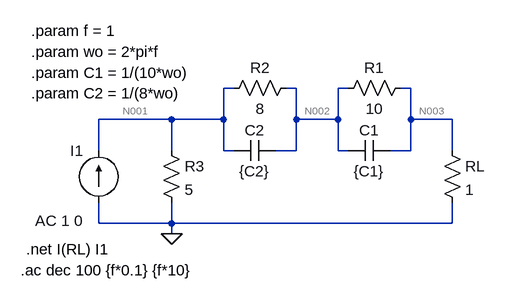
[diagram p0: schematic EJ1.asc]
EJ1.asc, the LTspice schematic file:
Version 4
SHEET 1 880 680
WIRE 144 32 128 32
WIRE 240 32 224 32
WIRE 320 32 304 32
WIRE 416 32 400 32
WIRE 48 80 -64 80
WIRE 128 80 128 32
WIRE 128 80 48 80
WIRE 240 80 240 32
WIRE 304 80 304 32
WIRE 304 80 240 80
WIRE 416 80 416 32
WIRE 480 80 416 80
WIRE -64 128 -64 80
WIRE 48 128 48 80
WIRE 128 128 128 80
WIRE 144 128 128 128
WIRE 240 128 240 80
WIRE 240 128 208 128
WIRE 304 128 304 80
WIRE 320 128 304 128
WIRE 416 128 416 80
WIRE 416 128 384 128
WIRE 480 128 480 80
WIRE -64 240 -64 208
WIRE 48 240 48 208
WIRE 48 240 -64 240
WIRE 480 240 480 208
WIRE 480 240 48 240
WIRE 48 256 48 240
FLAG 48 256 0
SYMBOL current -64 208 R180
WINDOW 0 24 80 Left 2
WINDOW 3 24 0 Left 2
WINDOW 123 24 -28 Left 2
WINDOW 39 0 0 Left 0
SYMATTR InstName I1
SYMATTR Value ""
SYMATTR Value2 AC 1 0
SYMBOL res 416 16 R90
WINDOW 0 0 56 VBottom 2
WINDOW 3 32 56 VTop 2
SYMATTR InstName R1
SYMATTR Value 10
SYMBOL cap 384 112 R90
WINDOW 0 0 32 VBottom 2
WINDOW 3 32 32 VTop 2
SYMATTR InstName C1
SYMATTR Value {C1}
SYMBOL cap 208 112 R90
WINDOW 0 0 32 VBottom 2
WINDOW 3 32 32 VTop 2
SYMATTR InstName C2
SYMATTR Value {C2}
SYMBOL res 240 16 R90
WINDOW 0 0 56 VBottom 2
WINDOW 3 32 56 VTop 2
SYMATTR InstName R2
SYMATTR Value 8
SYMBOL res 32 112 R0
SYMATTR InstName R3
SYMATTR Value 5
SYMBOL res 464 112 R0
SYMATTR InstName RL
SYMATTR Value 1
TEXT -168 -56 Left 2 !.param f = 1
TEXT -168 -24 Left 2 !.param wo = 2*pi*f
TEXT -168 8 Left 2 !.param C1 = 1/(10*wo)
TEXT -168 40 Left 2 !.param C2 = 1/(8*wo)
TEXT -176 280 Left 2 !.net I(RL) I1
TEXT -184 312 Left 2 !.ac dec 100 {f*0.1} {f*10}

The netlist it stands for:
* EJ1.asc
I1 0 N001 AC 1 0
R1 N003 N002 10
C1 N003 N002 {C1}
C2 N002 N001 {C2}
R2 N002 N001 8
R3 N001 0 5
RL N003 0 1
.param f = 1
.param wo = 2*pi*f
.param C1 = 1/(10*wo)
.param C2 = 1/(8*wo)
.net I(RL) I1
.ac dec 100 {f*0.1} {f*10}
.backanno
.end

* Results of the author's LTspice run, read from the files saved beside the schematic
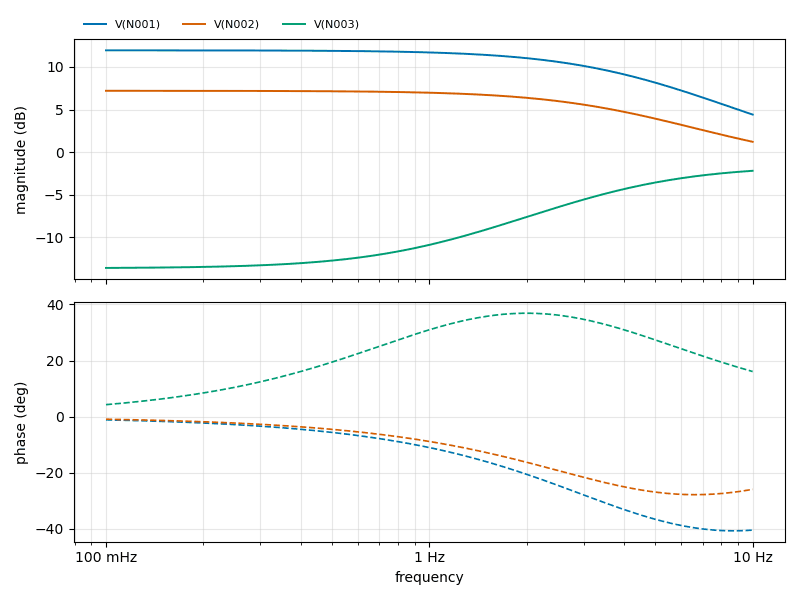
[diagram p1: AC Analysis of EJ1.asc, plotted from the saved traces]
* AC Analysis, 1 run:
*   V(N001): 11.95 dB at 100 mHz, 4.41 dB at 10 Hz, peak 11.95 dB at 100 mHz, 3 dB below the peak at 4.192 Hz
*   V(N002): 7.20 dB at 100 mHz, 1.22 dB at 10 Hz, peak 7.20 dB at 100 mHz, 3 dB below the peak at 4.667 Hz
*   V(N003): -13.58 dB at 100 mHz, -2.18 dB at 10 Hz, peak -2.18 dB at 10 Hz, 3 dB below the peak at 3.25 Hz